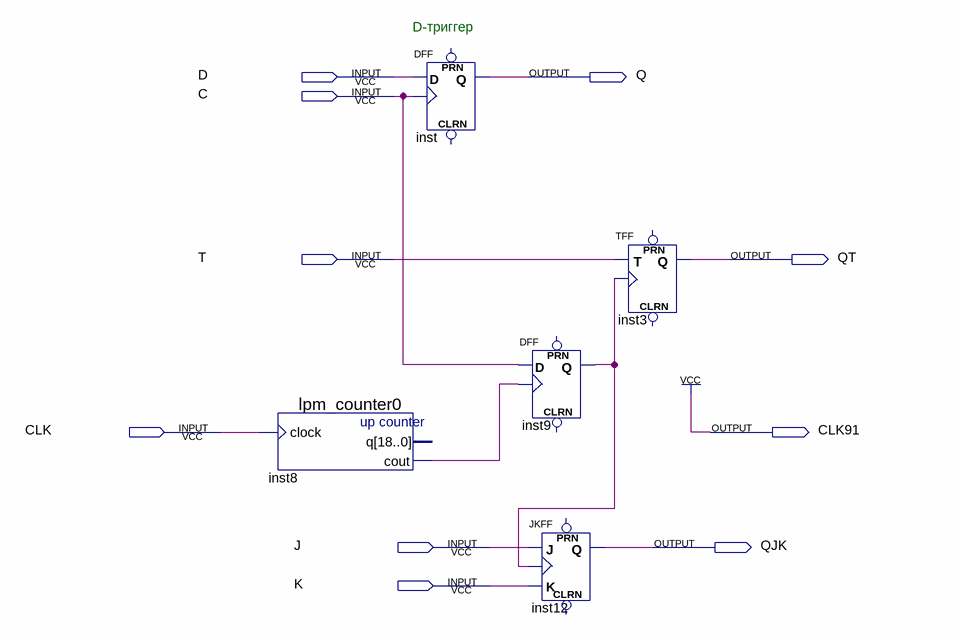
[diagram p0: schematic sheet]
// Quartus schematic D_T_JK-triggers.bdf as structural Verilog: 5 symbols, 10 pins
module \D_T_JK-triggers  (
  input  D,
  input  C,
  input  T,
  input  CLK,
  input  J,
  input  K,
  output Q,
  output QT,
  output CLK91,
  output QJK
);

  wire inst8_cout, inst9_q;

  lpm_counter0 inst8 (.clock(CLK), .cout(inst8_cout));  // open: q
  DFF inst (.CLK(C), .D(D), .Q(Q));  // open: CLRN, PRN
  DFF inst9 (.CLK(inst8_cout), .D(C), .Q(inst9_q));  // open: CLRN, PRN
  JKFF inst12 (.K(K), .J(J), .CLK(inst9_q), .Q(QJK));  // open: PRN, CLRN
  TFF inst3 (.T(T), .CLK(inst9_q), .Q(QT));  // open: PRN, CLRN

  assign CLK91 = 1'b1;

  // Notes on the sheet:
  //   D-триггер
endmodule
